# Altium schematic sheet interconnect.SchDoc
size A4; SheetNumber: 1; SheetTotal: 6
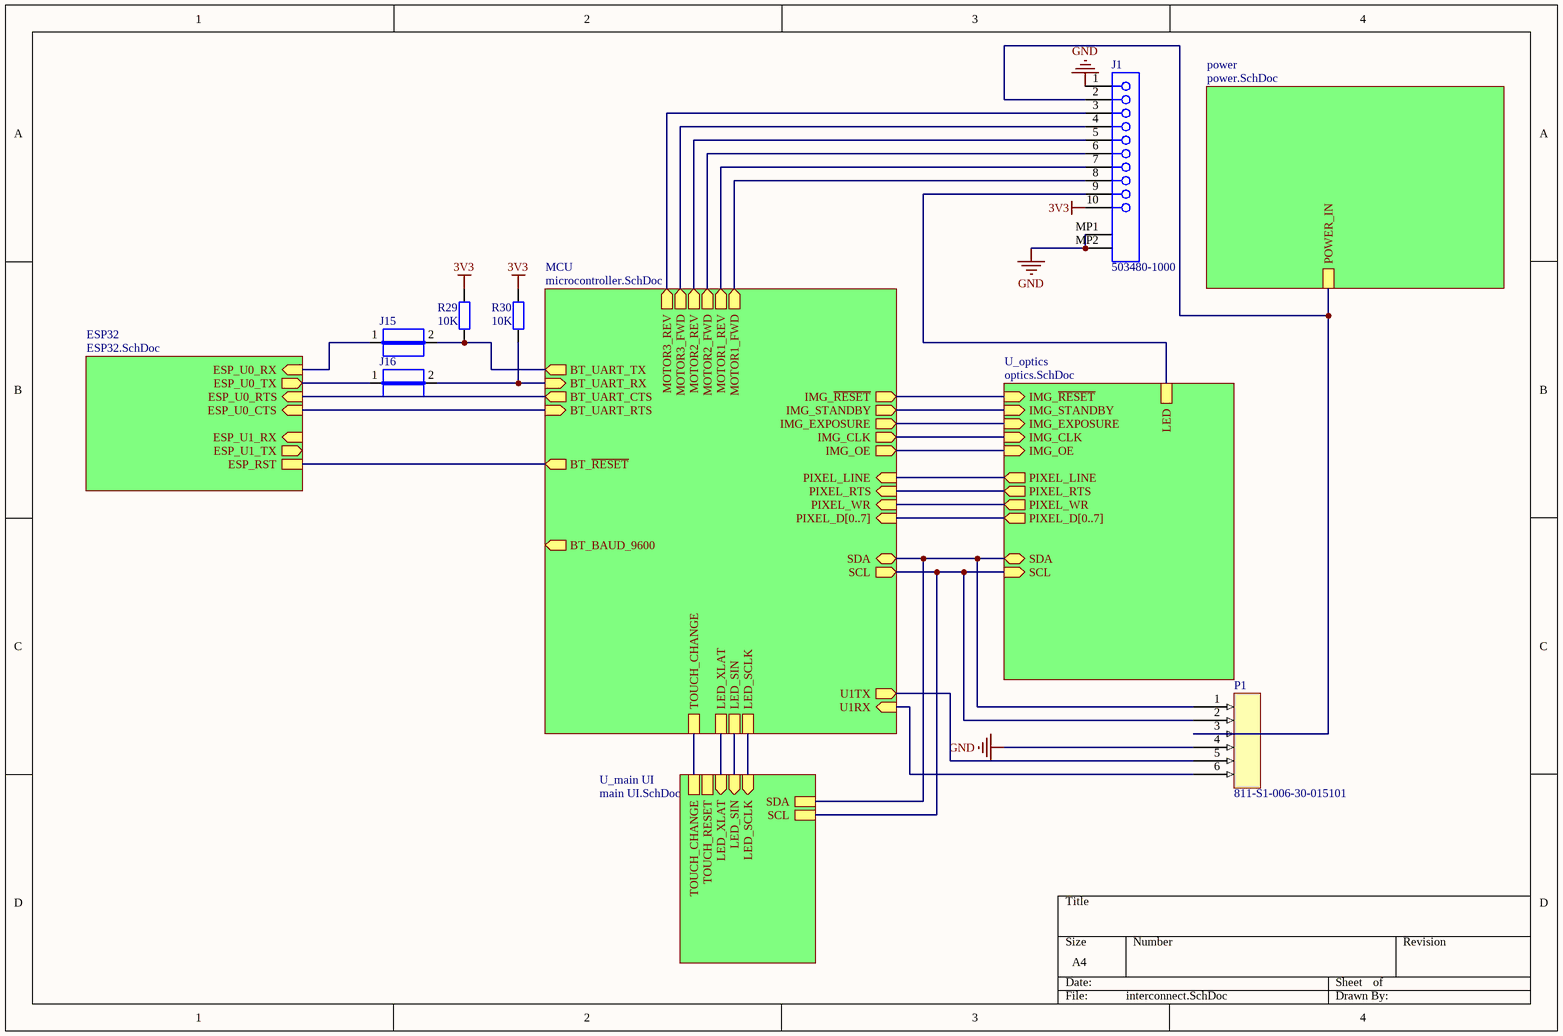
[diagram p0: interconnect.SchDoc]

## Parts
J1  503480-1000  [MOLX-503480-1000]
J15  JUMPER  [JUMPER]  (value not drawn)
J16  JUMPER  [JUMPER]  (value not drawn)
P1  811-S1-006-30-015101  [New footprint 1]
R29  10K  [1608[0603]_M]
R30  10K  [1608[0603]_M]

## Sub-sheets
ESP32 = ESP32.SchDoc: ESP_U0_RX (in), ESP_U1_TX (out), ESP_U0_TX (out), ESP_U1_RX (in), ESP_U0_CTS (in), ESP_U0_RTS (in), ESP_RST
MCU = microcontroller.SchDoc: SDA (bidir), IMG_STANDBY (out), IMG_EXPOSURE (out), BT_UART_RTS (in), BT_UART_CTS (out), MOTOR1_FWD (out), MOTOR1_REV (out), MOTOR2_FWD (out), MOTOR2_REV (out), MOTOR3_FWD (out), BT_~{RESET} (out), IMG_~{RESET} (out), IMG_CLK (out), PIXEL_LINE (in), IMG_OE (out), BT_BAUD_9600 (out), PIXEL_RTS (in), PIXEL_WR (in), MOTOR3_REV (out), SCL (out), PIXEL_D[0..7] (in), LED_SIN, TOUCH_CHANGE, LED_XLAT, LED_SCLK, BT_UART_TX (out), BT_UART_RX (in), U1TX (out), U1RX (in)
power = power.SchDoc: POWER_IN
U_main UI = main UI.SchDoc: LED_SCLK (in), LED_SIN (in), LED_XLAT (in), SDA, TOUCH_RESET, TOUCH_CHANGE, SCL
U_optics = optics.SchDoc: IMG_~{RESET} (in), IMG_CLK (in), IMG_EXPOSURE (in), IMG_STANDBY (in), SCL (in), SDA (bidir), PIXEL_WR (out), PIXEL_RTS (out), PIXEL_D[0..7] (out), PIXEL_LINE (out), IMG_OE (in), LED

## Nets
3V3: J1.10 R29.2 R30.2
GND: J1.1 J1.MP1 J1.MP2 P1.4
NetJ1_2: J1.2 P1.3 ; sheet power/POWER_IN
NetJ1_3: J1.3 ; sheet MCU/MOTOR3_REV
NetJ1_4: J1.4 ; sheet MCU/MOTOR3_FWD
NetJ1_5: J1.5 ; sheet MCU/MOTOR2_REV
NetJ1_6: J1.6 ; sheet MCU/MOTOR2_FWD
NetJ1_7: J1.7 ; sheet MCU/MOTOR1_REV
NetJ1_8: J1.8 ; sheet MCU/MOTOR1_FWD
NetJ1_9: J1.9 ; sheet U_optics/LED
NetJ15_1: J15.1 ; sheet ESP32/ESP_U0_RX
NetJ15_2: J15.2 R29.1 ; sheet MCU/BT_UART_TX
NetJ16_1: J16.1 ; sheet ESP32/ESP_U0_TX
NetJ16_2: J16.2 R30.1 ; sheet MCU/BT_UART_RX
NetP1_1: P1.1 ; sheet MCU/SDA, sheet U_optics/SDA, sheet U_main UI/SDA
NetP1_2: P1.2 ; sheet MCU/SCL, sheet U_optics/SCL, sheet U_main UI/SCL
NetP1_5: P1.5 ; sheet MCU/U1TX
NetP1_6: P1.6 ; sheet MCU/U1RX
(unnamed): sheet ESP32/ESP_U0_CTS, sheet MCU/BT_UART_RTS
(unnamed): sheet ESP32/ESP_U0_RTS, sheet MCU/BT_UART_CTS
(unnamed): sheet ESP32/ESP_RST, sheet MCU/BT_~{RESET}
(unnamed): sheet MCU/IMG_STANDBY, sheet U_optics/IMG_STANDBY
(unnamed): sheet MCU/IMG_EXPOSURE, sheet U_optics/IMG_EXPOSURE
(unnamed): sheet MCU/IMG_~{RESET}, sheet U_optics/IMG_~{RESET}
(unnamed): sheet MCU/IMG_CLK, sheet U_optics/IMG_CLK
(unnamed): sheet MCU/PIXEL_LINE, sheet U_optics/PIXEL_LINE
(unnamed): sheet MCU/IMG_OE, sheet U_optics/IMG_OE
(unnamed): sheet MCU/PIXEL_RTS, sheet U_optics/PIXEL_RTS
(unnamed): sheet MCU/PIXEL_WR, sheet U_optics/PIXEL_WR
(unnamed): sheet MCU/LED_SIN, sheet U_main UI/LED_SIN
(unnamed): sheet MCU/TOUCH_CHANGE, sheet U_main UI/TOUCH_CHANGE
(unnamed): sheet MCU/LED_XLAT, sheet U_main UI/LED_XLAT
(unnamed): sheet MCU/LED_SCLK, sheet U_main UI/LED_SCLK

## Buses and harness runs
bus sheet MCU/PIXEL_D[0..7] = sheet U_optics/PIXEL_D[0..7]

## Library data of the parts
J1 = CMP-1241-00115-1: 0.5 mm Pitch Easy-On(TM) BackFlip(TM) Type FPC Connector, 1.0 mm Mated Height, Right Angle, SMT, Dual Contact, 10 Circuits, -40 to 85 degC, ELV and RoHS Compliant, Tape and Reel; Manufacturer: Molex; Durability (mating cycles max): 10; Pitch - Mating Interface: 0.50mm; Material - Plating Mating: Gold; Voltage (Max): 50V AC (RMS)/DC; Polarized to PCB: Yes; PCB Locator: No; Current (Max per Contact): 0.5A; Material - Plating Termination: Gold, Tin; Entry Angle: 90degrees Angle; Mated Height: 1.00mm; Material - Metal: Phosphor Bronze; ComponentLink1Description: Manufacturer URL; PartNumber: 503480-1000; Circuits (Loaded): 10; Packing: Tape and Reel; PackageReference: 503480-1000; ComponentLink2URL: http://www.molex.com/webdocs/datasheets/pdf/en-us/5034801000_FFC_FPC_CONNECTORS.pdf; PackageVersion: Rev. F, 09/2012; ComponentLink3Description: Package Specification; ComponentLink3URL: http://www.molex.com/pdm_docs/sd/5034801000_sd.pdf; PackageDescription: 10-Lead FPC Connector, Pitch 0.5 mm; Stackable: No; Mounting Technology: Surface Mount; ComponentLink2Description: Datasheet; PCB Retention: Yes; Number of Rows: 1; Orientation: Right Angle; Contact Position: Dual; RoHS: TRUE; ComponentLink1URL: http://www.molex.com/molex/index.jsp
J15 J16 = CMP-009-00061-1: Pins: 2
P1 = CMP-002-00071-6: Conn Spring Piston 6POS SMD
R29 R30 = Resistor: Generic Resistor; Value: 10K